# Altium schematic sheet 05-7Segment(74HC595).SchDoc
size A
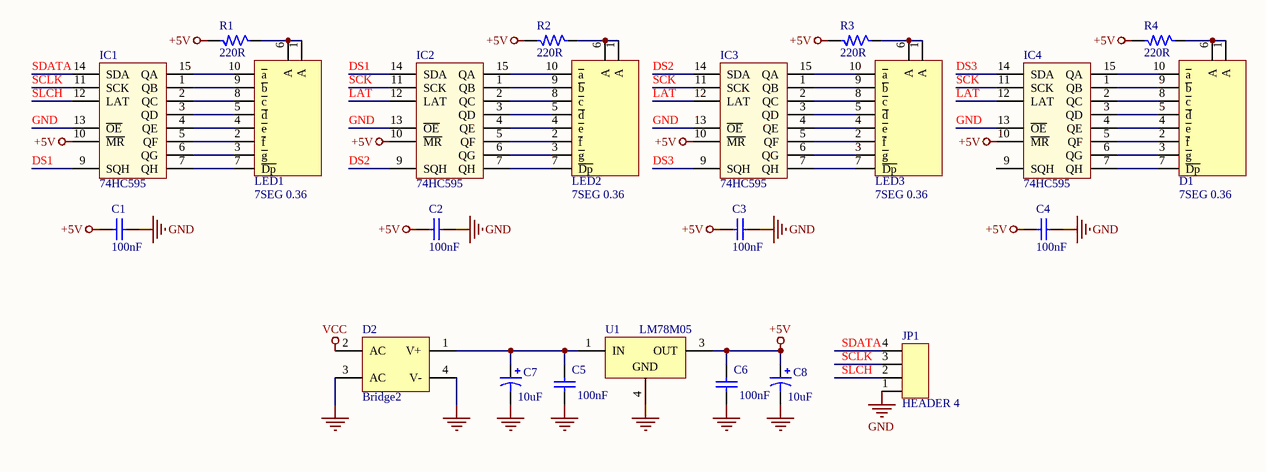
[diagram p0: 05-7Segment(74HC595).SchDoc]

## Parts
C1  value 100nF  [RAD-0.3]  (hidden comment: 104)
C2  value 100nF  [RAD-0.3]  (hidden comment: 104)
C3  value 100nF  [RAD-0.3]  (hidden comment: 104)
C4  value 100nF  [RAD-0.3]  (hidden comment: 104)
C5  value 100nF  [RAD-0.3]  (hidden comment: 104)
C6  value 100nF  [RAD-0.3]  (hidden comment: 104)
C7  value 10uF  [RB7.6-15]  (hidden comment: 10uF/16V)
C8  value 10uF  [RB7.6-15]  (hidden comment: 10uF/16V)
D1  7SEG 0.36  [LED7-0.36inch]
D2  Bridge2  [D-46_6A]
IC1  74HC595  [SOIC-16]
IC2  74HC595  [SOIC-16]
IC3  74HC595  [SOIC-16]
IC4  74HC595  [SOIC-16]
JP1  HEADER 4  [JP4]
LED1  7SEG 0.36  [LED7-0.36inch]
LED2  7SEG 0.36  [LED7-0.36inch]
LED3  7SEG 0.36  [LED7-0.36inch]
R1  220R  [R-0805]
R2  220R  [R-0805]
R3  220R  [R-0805]
R4  220R  [R-0805]
U1  value LM78M05  [NDP0003B_M]  (hidden comment: LM78M05CDTX)

## Nets
+5V: C1.1 C2.1 C3.1 C4.1 C6.1 C8.1 IC1.10(~{MR}) IC1.16(VCC) IC2.10(~{MR}) IC2.16(VCC) IC3.10(~{MR}) IC3.16(VCC) IC4.10(~{MR}) IC4.16(VCC) R1.2 R2.2 R3.2 R4.2 U1.3(OUT)
GND: C1.2 C2.2 C3.2 C4.2 C5.2 C6.2 C7.2 C8.2 D2.3(AC) D2.4(V-) IC1.8(GND) IC1.13(~{OE}) IC2.8(GND) IC2.13(~{OE}) IC3.8(GND) IC3.13(~{OE}) IC4.8(GND) IC4.13(~{OE}) JP1.1 U1.4(GND)
VCC: D2.2(AC)
DS1: IC1.9(SQH) IC2.14(SDA)
DS2: IC2.9(SQH) IC3.14(SDA)
DS3: IC3.9(SQH) IC4.14(SDA)
LAT: IC2.12(LAT) IC3.12(LAT) IC4.12(LAT)
SCK: IC2.11(SCK) IC3.11(SCK) IC4.11(SCK)
SCLK: IC1.11(SCK) JP1.3
SDATA: IC1.14(SDA) JP1.4
SLCH: IC1.12(LAT) JP1.2
NetC5_1: C5.1 C7.1 D2.1(V+) U1.1(IN)
NetD1_1: D1.1(A) D1.6(A) R4.1
NetD1_2: D1.2(~{f}) IC4.5(QF)
NetD1_3: D1.3(~{g}) IC4.6(QG)
NetD1_4: D1.4(~{e}) IC4.4(QE)
NetD1_5: D1.5(~{d}) IC4.3(QD)
NetD1_7: D1.7(~{Dp}) IC4.7(QH)
NetD1_8: D1.8(~{c}) IC4.2(QC)
NetD1_9: D1.9(~{b}) IC4.1(QB)
NetD1_10: D1.10(~{a}) IC4.15(QA)
NetIC1_1: IC1.1(QB) LED1.9(~{b})
NetIC1_2: IC1.2(QC) LED1.8(~{c})
NetIC1_3: IC1.3(QD) LED1.5(~{d})
NetIC1_4: IC1.4(QE) LED1.4(~{e})
NetIC1_5: IC1.5(QF) LED1.2(~{f})
NetIC1_6: IC1.6(QG) LED1.3(~{g})
NetIC1_7: IC1.7(QH) LED1.7(~{Dp})
NetIC1_15: IC1.15(QA) LED1.10(~{a})
NetIC2_1: IC2.1(QB) LED2.9(~{b})
NetIC2_2: IC2.2(QC) LED2.8(~{c})
NetIC2_3: IC2.3(QD) LED2.5(~{d})
NetIC2_4: IC2.4(QE) LED2.4(~{e})
NetIC2_5: IC2.5(QF) LED2.2(~{f})
NetIC2_6: IC2.6(QG) LED2.3(~{g})
NetIC2_7: IC2.7(QH) LED2.7(~{Dp})
NetIC2_15: IC2.15(QA) LED2.10(~{a})
NetIC3_1: IC3.1(QB) LED3.9(~{b})
NetIC3_2: IC3.2(QC) LED3.8(~{c})
NetIC3_3: IC3.3(QD) LED3.5(~{d})
NetIC3_4: IC3.4(QE) LED3.4(~{e})
NetIC3_5: IC3.5(QF) LED3.2(~{f})
NetIC3_6: IC3.6(QG) LED3.3(~{g})
NetIC3_7: IC3.7(QH) LED3.7(~{Dp})
NetIC3_15: IC3.15(QA) LED3.10(~{a})
NetLED1_1: LED1.1(A) LED1.6(A) R1.1
NetLED2_1: LED2.1(A) LED2.6(A) R2.1
NetLED3_1: LED3.1(A) LED3.6(A) R3.1

Not connected (* = marked no-connect by the designer): IC4 9(SQH)

## Library data of the parts
C1-C6 = Cap: Capacitor; Published: 8-Jun-2000; LatestRevisionDate: 17-Jul-2002; LatestRevisionNote: Re-released for DXP Platform.; PackageReference: RAD-0.3; Publisher: Altium Limited; PackageDescription: Radial Cap, Thru-Hole; 2 Leads; 0.3 in Pin Spacing
C7 C8 = Cap Pol1: Polarized Capacitor (Radial); Published: 8-Jun-2000; LatestRevisionDate: 17-Jul-2002; LatestRevisionNote: Re-released for DXP Platform.; PackageReference: RB7.6-15; Publisher: Altium Limited; PackageDescription: Polarized Capacitor (Radial); 2 Leads
D1 LED1-LED3 = 7SEG0.36S: Value: 7SEG
D2 = Bridge2: Diode Bridge; Published: 24-Mar-1999; LatestRevisionDate: 17-Jul-2002; LatestRevisionNote: Re-released for DXP Platform.; PackageReference: D-46_6A; Publisher: Altium Limited; PackageDescription: Bridge Rectifier; 4 Terminals; Body 16.8 x 16.8 mm (typ); Pitch 10.67 mm
IC1-IC4 = 74595: 8 Bit Serial input - Parallel Output; Value: 74HC595
JP1 = JP4
R1-R4 = R: Resistor 1/4W; Value: R1/4W - 1K
U1 = CMP-0062-00204-3: 3-Terminal Positive Voltage Regulators, 3-pin TO-252; Manufacturer: Texas Instruments; PackageTopMarking: NSUZXYTT*LM78M05*CDT; PowerWise: N; CompType: LDO IC; ComponentLink1Description: Datasheet URL; ComponentLink1URL: http://www.ti.com/general/docs/lit/getliterature.tsp?genericPartNumber=LM78M05&fileType=pdf; PackageReference: NDP0003B; Code_JEDEC: TO-252-AA; PinCount: 3; PackageDescription: TO252, Molded, Jedec, 6.8 x 6.10 x 2.30mm Body, 3 Lead, 2.28mm Pitch, Surface Mount